# Altium schematic sheet CAN_Interface.SchDoc
size A; SheetNumber: 7; SheetTotal: 8
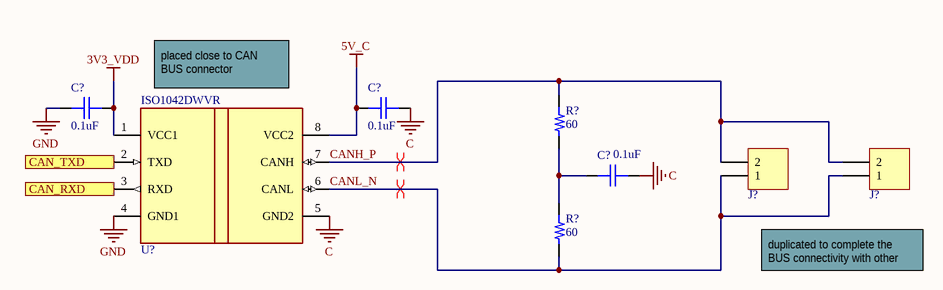
[diagram p0: CAN_Interface.SchDoc]

## Parts
(Parts that share a designator on the sheet are numbered #1, #2 ... from top to bottom, then left to right.)
C?#1  value 0.1uF  [C0402]  (hidden comment: Capacitor)
C?#2  value 0.1uF  [C0402]  (hidden comment: Capacitor)
C?#3  value 0.1uF  [C0402]  (hidden comment: Capacitor)
J?#1  2 Position-5.08mm Pitch Terminal Block  [Terminal_Block_2 Pin_5.08mm]  (value not drawn)
J?#2  2 Position-5.08mm Pitch Terminal Block  [Terminal_Block_2 Pin_5.08mm]  (value not drawn)
R?#1  value 60  [R0402]  (hidden comment: Resistor)
R?#2  value 60  [R0402]  (hidden comment: Resistor)
U?  value ISO1042DWVR  [ISO1042DWVR]  (hidden comment: CAN Transceiver)

## Ports
CAN_RXD (out), CAN_TXD (in)

## Nets
3V3_VDD: C?#1.1 U?.1(VCC1)
5V_C: C?#2.1 U?.8(VCC2)
C: C?#2.1 C?#3.1 U?.5(GND2)
GND: C?#1.1 U?.4(GND1)
CAN_RXD: U?.3(RXD) ; port CAN_RXD
CAN_TXD: U?.2(TXD) ; port CAN_TXD
CANH_P: J?#1.2 J?#2.2 R?#1.1 U?.7(CANH)
CANL_N: J?#1.1 J?#2.1 R?#2.1 U?.6(CANL)
NetC?#3_1: C?#3.1 R?#1.1 R?#2.1

## Layout directives
differential pair; differential pair class CAN: CANH_P, CANL_N

## Notes on the sheet
- placed close to CAN BUS connector
- duplicated to complete the BUS connectivity with other nodes

## Library data of the parts
C?#1-C?#3 = CAP_SMT: ComponentLink1Description: New link
J?#1 J?#2 = Terminal Block 2P: ComponentLink1Description: New link; ComponentLink1URL: *
R?#1 R?#2 = RES_SMT: ComponentLink1Description: New link; ComponentLink1URL: *
U? = ISO1042DWVR: CAN Interface IC Isolated CAN transceiver with 70-V bus fault protection & flexible data rate 8-SOIC -40 to 125; ComponentLink1Description: New link